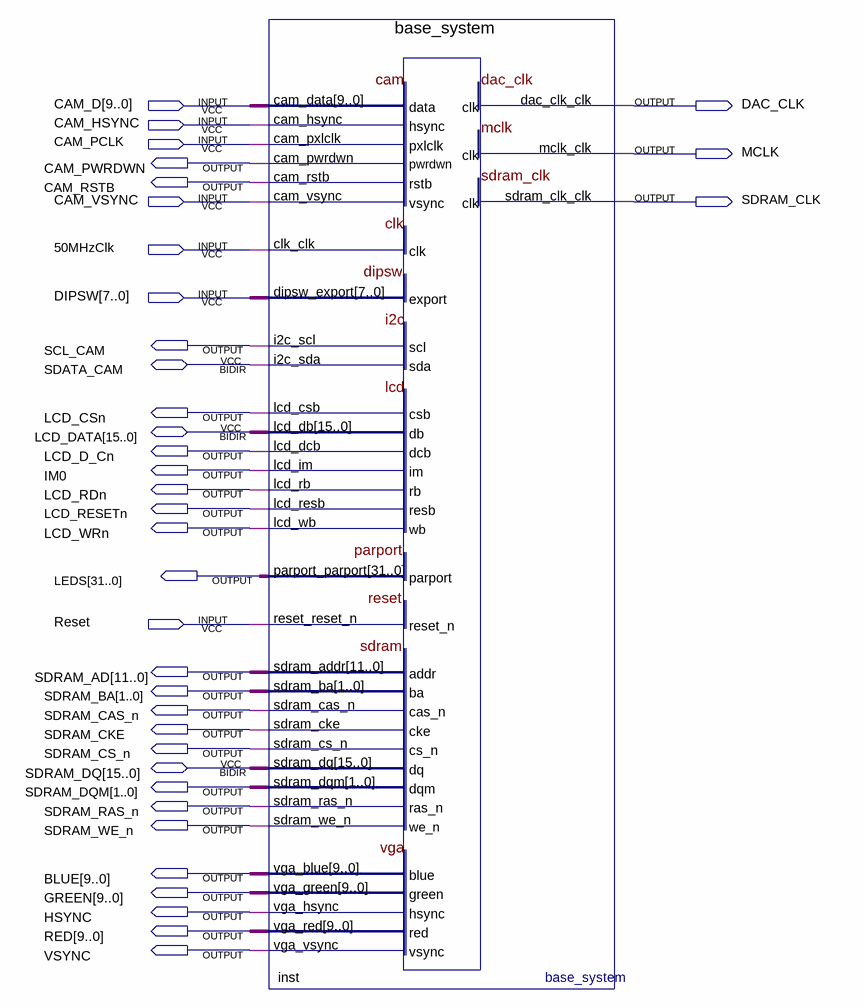
[diagram p0: schematic sheet]
// Quartus schematic mse_demo.bdf as structural Verilog: 1 symbols, 36 pins
module mse_demo (
  input  [9:0] CAM_D,
  input  CAM_HSYNC,
  input  CAM_PCLK,
  input  CAM_VSYNC,
  input  \50MHzClk ,
  input  [7:0] DIPSW,
  input  Reset,
  inout  SDATA_CAM,
  inout  [15:0] LCD_DATA,
  inout  [15:0] SDRAM_DQ,
  output DAC_CLK,
  output MCLK,
  output CAM_PWRDWN,
  output CAM_RSTB,
  output SDRAM_CLK,
  output SCL_CAM,
  output LCD_CSn,
  output LCD_D_Cn,
  output IM0,
  output LCD_RDn,
  output LCD_RESETn,
  output LCD_WRn,
  output [31:0] LEDS,
  output [11:0] SDRAM_AD,
  output [1:0] SDRAM_BA,
  output SDRAM_CAS_n,
  output SDRAM_CKE,
  output SDRAM_CS_n,
  output [1:0] SDRAM_DQM,
  output SDRAM_RAS_n,
  output SDRAM_WE_n,
  output [9:0] BLUE,
  output [9:0] GREEN,
  output HSYNC,
  output [9:0] RED,
  output VSYNC
);

  base_system inst (
    .cam_data(CAM_D), .cam_hsync(CAM_HSYNC), .cam_pxlclk(CAM_PCLK), .cam_vsync(CAM_VSYNC),
    .clk_clk(\50MHzClk ), .dipsw_export(DIPSW), .reset_reset_n(Reset), .cam_pwrdwn(CAM_PWRDWN),
    .cam_rstb(CAM_RSTB), .dac_clk_clk(DAC_CLK), .i2c_scl(SCL_CAM), .lcd_csb(LCD_CSn), .lcd_dcb(LCD_D_Cn),
    .lcd_im(IM0), .lcd_rb(LCD_RDn), .lcd_resb(LCD_RESETn), .lcd_wb(LCD_WRn), .mclk_clk(MCLK),
    .sdram_addr(SDRAM_AD), .sdram_ba(SDRAM_BA), .sdram_cas_n(SDRAM_CAS_n), .sdram_cke(SDRAM_CKE),
    .sdram_cs_n(SDRAM_CS_n), .sdram_dqm(SDRAM_DQM), .sdram_ras_n(SDRAM_RAS_n), .sdram_we_n(SDRAM_WE_n),
    .sdram_clk_clk(SDRAM_CLK), .vga_blue(BLUE), .vga_green(GREEN), .vga_hsync(HSYNC), .vga_red(RED),
    .vga_vsync(VSYNC), .i2c_sda(SDATA_CAM), .lcd_db(LCD_DATA), .parport_parport(LEDS), .sdram_dq(SDRAM_DQ));
endmodule
